# Altium schematic sheet Instrumentation_Amp.SchDoc
size A4; SheetNumber: 4; SheetTotal: 7
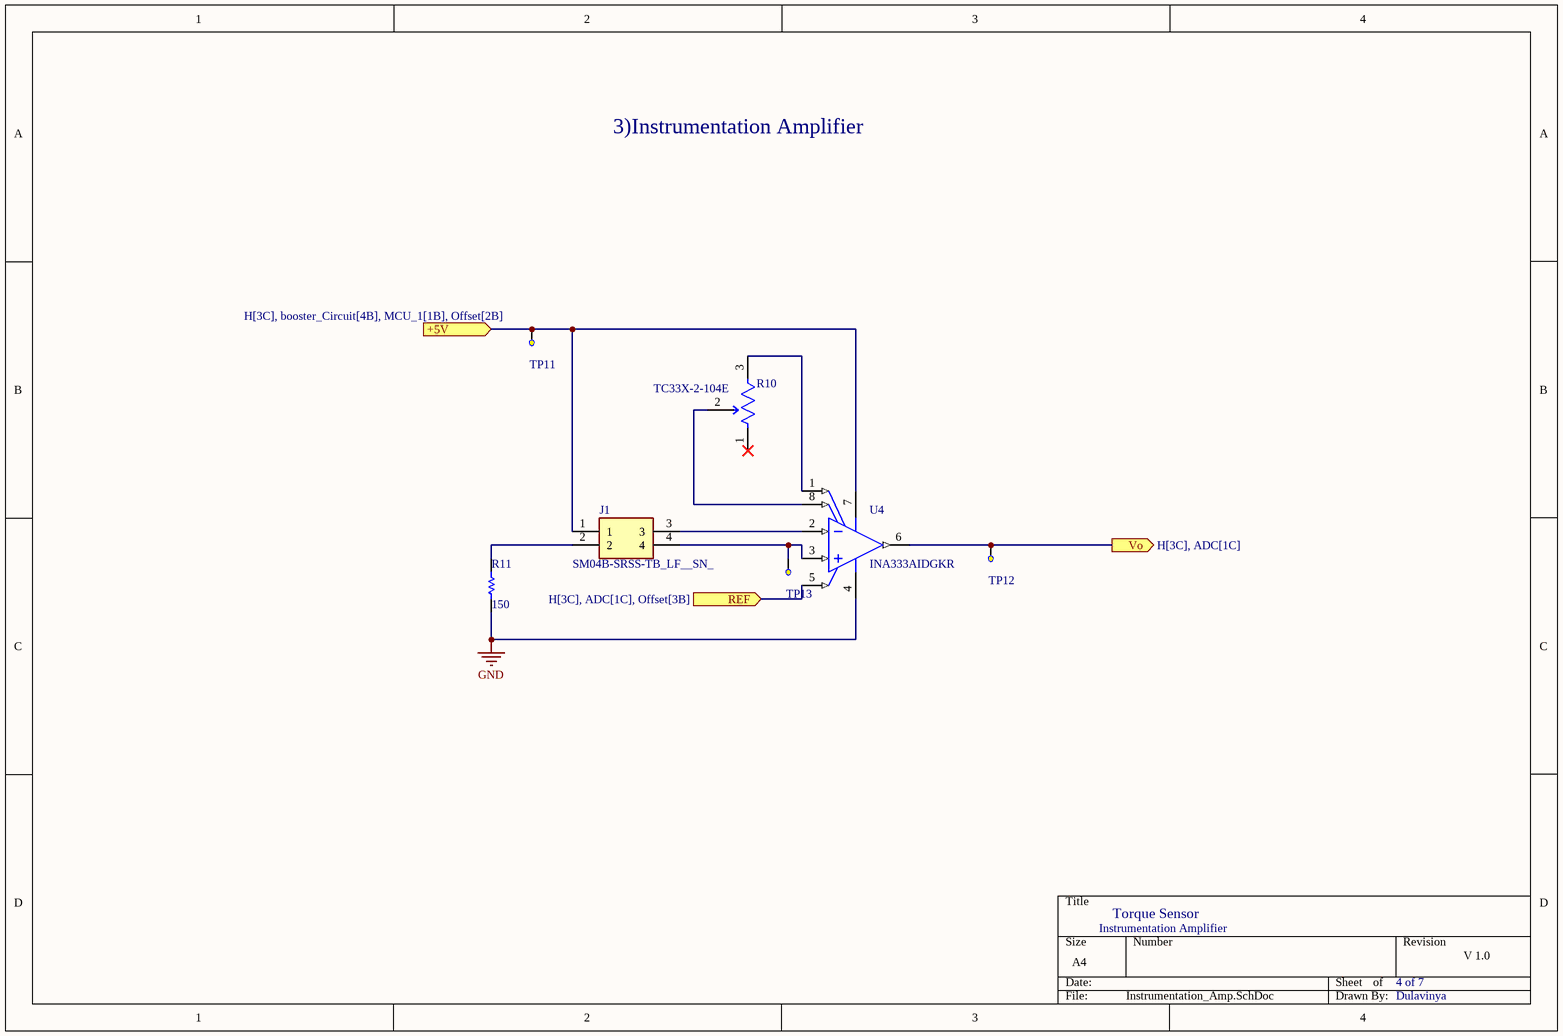
[diagram p0: Instrumentation_Amp.SchDoc]

## Parts
J1  SM04B-SRSS-TB_LF__SN_  [SM04B-SRSS-TB(LFSN)]
R10  TC33X-2-104E  [FP-TC33X-2-MFG]
R11  150  [RESC1005X40X25LL05T10]
TP11  Test point  [Test_point]  (value not drawn)
TP12  Test point  [Test_point]  (value not drawn)
TP13  Test point  [Test_point]  (value not drawn)
U4  INA333AIDGKR  [DGK0008A_N]

## Ports
+5V (in, see H[3C], booster_Circuit[4B], MCU_1[1B], Offset[2B]), REF (in, see H[3C], ADC[1C], Offset[3B]), Vo (out, see H[3C], ADC[1C])

## Nets
GND: R11.1 U4.4(V-)
+5V: J1.1 TP11.TP?(Test_point) U4.7(V+) ; port +5V
REF: U4.5(REF) ; port REF
Vo: TP12.TP?(Test_point) U4.6(VOUT) ; port Vo
NetJ1_2: J1.2 R11.2
NetJ1_3: J1.3 U4.2(VIN-)
NetJ1_4: J1.4 TP13.TP?(Test_point) U4.3(VIN+)
NetR10_2: R10.2(WIPER) U4.8(RG)
NetR10_3: R10.3(CW) U4.1(RG)

Not connected (* = marked no-connect by the designer): R10 1(CCW)*

## Notes on the sheet
- 3)Instrumentation Amplifier
- Torque Sensor
- Instrumentation Amplifier
- 4 of 7
- V 1.0
- Dulavinya

## Library data of the parts
J1 = SM04B-SRSS-TB_LF__SN_: Connector; Manufacturer_Name: JST (JAPAN SOLDERLESS TERMINALS); Manufacturer_Part_Number: SM04B-SRSS-TB(LF)(SN); Datasheet Link: http://www.jst-mfg.com/product/pdf/eng/eSH.pdf; Mouser Part Number: 306-SM04BSRSSTBLFSN; Mouser Price/Stock: https://www.mouser.co.uk/ProductDetail/JST-Commercial/SM04B-SRSS-TBLFSN?qs=cdbOS8ANM9B3FdyA6cNU2A%3D%3D; Arrow Part Number: SM04B-SRSS-TB(LF)(SN); Arrow Price/Stock: https://www.arrow.com/en/products/sm04b-srss-tb-lf-sn/jst-manufacturing?utm_currency=USD&region=europe
R10 = CMP-07234-000040-1: TRIMMER 100K OHM 0.1W J LEAD TOP; Number of Turns: 1; Voltage Rating (DC): 50V; Power Rating: 100mW; Resistance Tolerance: 25%; Resistance: 100kR; Temperature Coefficient: 250ppm/°C; Max Operating Temperature: 100°C; Package Quantity: 2500; REACH SVHC: No SVHC; Termination: Foot Print; Packaging: Tape and Reel; RoHS Compliant: Yes; Military Standard: Not; Color: Silver; Width: 0.118inch; Min Operating Temperature: -40°C; Mount: Surface Mount; Height: 0.047inch; Tolerance: 25%; Resistor Type: Carbon; Length: 3mm; Depth: 3.8mm; Weight: 29.4mg; Max Power Dissipation: 100mW; Series: TC33; Radiation Hardening: No
R11 = CMP-2002-07401-1: Part Number: RC0402FR-07150RL; Manufacturer: Yageo / Phycomp
TP11-TP13 = test_point: Value: Test point
U4 = CMP-0944-00088-2: Low Power, Precision Instrumentation Amplifier, -40 to 125 degC, 8-pin SOP (DGK8), Green (RoHS & no Sb/Br); Manufacturer: Texas Instruments; Input Offset Drift (+/-)(Max)(uV/Degrees Celsius): 0.1; Vs(Max)(V): 5.5; Input Bias Current (+/-)(Max)(nA): 0.2; Output Offset (+/-)(Max)(uV): 75/G; CMRR(Min)(dB): 100; Noise at 1kHz(Typ)(nV/rt(Hz)): 50; Output Offset Drift (+/-)(Max)(uV/Degrees Celsius): 0.5/G; Vs(Min)(V): 1.8; Quiescent Current (+/-)(Typ)(mA): 0.05; Gain(V/V): 1 to 1000; SubFamily: Single Supply; Number of Channels: 1; Input Offset (+/-)(Max)(uV): 25; Code_JEDEC: MO-187; Eco-Plan: Green (RoHS & no Sb/Br); ComponentLink2URL: http://www.ti.com/general/docs/lit/getliterature.tsp?genericPartNumber=INA333&fileType=pdf; Mounting Technology: Surface Mount; PartNumber: INA333AIDGKR; ComponentLink3URL: http://www.ti.com/litv/pdf/mpds028d; ComponentLink1URL: http://www.ti.com/; DatasheetVersion: SBOS445B; ComponentLink2Description: Datasheet; PackageVersion: 4073329/E, 05/2006; PackageReference: DGK0008A; ComponentLink3Description: Package Specification; PackageDescription: 8-Pin Thin Small Outline, Body 3 x 3 mm, Pitch 0.65 mm; ComponentLink1Description: Manufacturer URL